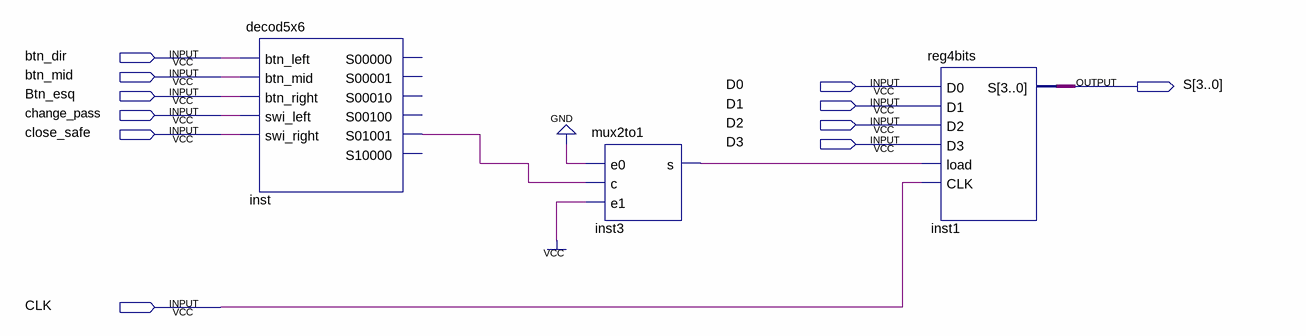
[diagram p0: schematic sheet]
// Quartus schematic reg_decod.bdf as structural Verilog: 3 symbols, 11 pins
module reg_decod (
  input  btn_dir,
  input  btn_mid,
  input  D0,
  input  Btn_esq,
  input  D1,
  input  change_pass,
  input  D2,
  input  close_safe,
  input  D3,
  input  CLK,
  output [3:0] S
);

  wire inst3_s, inst_s01001;

  decod5x6 inst (
    .btn_left(btn_dir), .btn_mid(btn_mid), .btn_right(Btn_esq), .swi_left(change_pass),
    .swi_right(close_safe), .S01001(inst_s01001));  // open: S00000, S00001, S00010, S00100, S10000
  mux2to1 inst3 (.e0(1'b0), .c(inst_s01001), .e1(1'b1), .s(inst3_s));
  reg4bits inst1 (.D0(D0), .D1(D1), .D2(D2), .D3(D3), .load(inst3_s), .CLK(CLK), .S(S));
endmodule
